# EAGLE design PCB 2.3 (EAGLE 7.6.0)
CNAME: DIY-Thermocam V2; CREVISION: 2.3; DESIGNER: Max Ritter
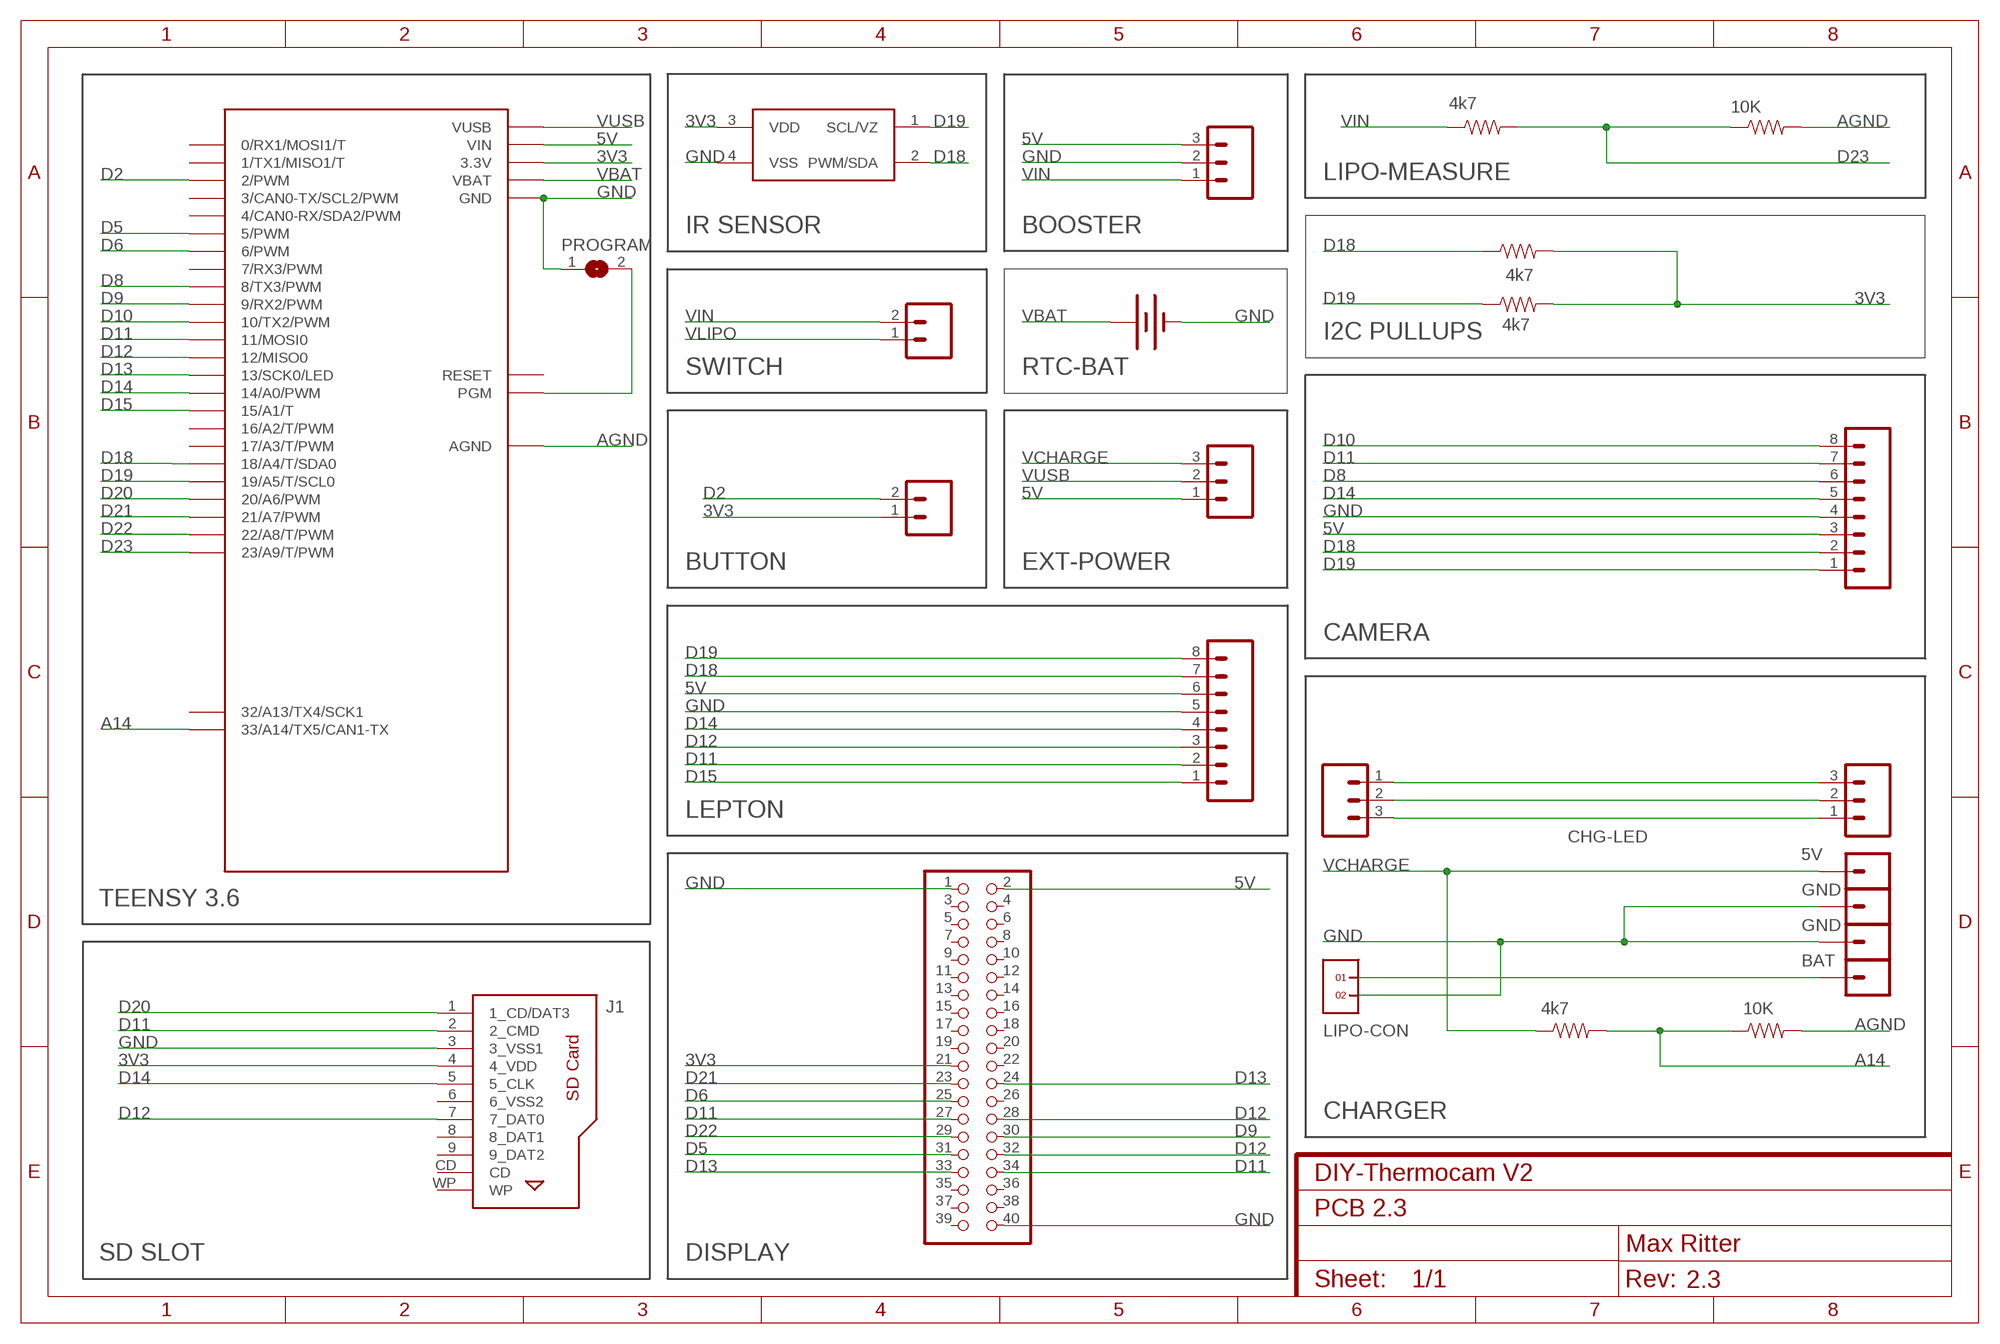
[diagram p0: schematic, sheet 1]

## Parts
BAT  BATTERY12PTH  [BATTCON_12MM_PTH]
BOOSTER  M03PTH  [1X03]
BUTTON  M02PTH  [1X02]
CHG-LED  M03PTH  [1X03]
EXT-POWER  M03PTH  [1X03]
J1  693063020911  [693063020911]
JP1  M01PTH  [1X01]
JP2  M01PTH  [1X01]
JP3  M01PTH  [1X01]
JP4  M01PTH  [1X01]
LASER1  M03PTH  [1X03]
LCD-HEADER  PINHD-2X20  [2X20]
LEPTON_MODULE  M08  [1X08_ROUND]
LEPTON_MODULE1  M08  [1X08_ROUND]
LIPO-CON  1X2  [1X2]
PROGRAM  SJ  [SJ]
R1  4k7  RESISTORPTH-1/4W  [AXIAL-0.4]
R2  10K  RESISTORPTH-1/4W  [AXIAL-0.4]
R3  4k7  RESISTORPTH-1/4W  [AXIAL-0.4]
R4  4k7  RESISTORPTH-1/4W  [AXIAL-0.4]
R5  10K  RESISTORPTH-1/4W  [AXIAL-0.4]
R6  4k7  RESISTORPTH-1/4W  [AXIAL-0.4]
SWITCH  M02PTH  [1X02]
U1  MLX90614_  [TO-39]
U$1  TEENSY_3.6_ALL_PINS  [TEENSY_3.6_ALL_PINS]

## Nets
3V3: BUTTON.1 J1.4(4_VDD) LCD-HEADER.21 R4.P$2 R6.P$2 U1.3(VDD) U$1.3.3V U$1.3.3V3(3.3V) U$1.3.3V4(3.3V)
5V: BOOSTER.3 EXT-POWER.1 LCD-HEADER.2 LEPTON_MODULE1.3 LEPTON_MODULE.6 U$1.VIN
A14: R3.P$2 R5.P$1 U$1.33/A14(33/A14/TX5/CAN1-TX)
AGND: R2.P$2 R5.P$2 U$1.AGND
D2: BUTTON.2 U$1.2(2/PWM)
D5: LCD-HEADER.31 U$1.5(5/PWM)
D6: LCD-HEADER.25 U$1.6(6/PWM)
D8: LEPTON_MODULE1.6 U$1.8(8/TX3/PWM)
D9: LCD-HEADER.30 U$1.9(9/RX2/PWM)
D10: LEPTON_MODULE1.8 U$1.10(10/TX2/PWM)
D11: J1.2(2_CMD) LCD-HEADER.27 LCD-HEADER.34 LEPTON_MODULE1.7 LEPTON_MODULE.2 U$1.11(11/MOSI0)
D12: J1.7(7_DAT0) LCD-HEADER.28 LCD-HEADER.32 LEPTON_MODULE.3 U$1.12(12/MISO0)
D13: LCD-HEADER.24 LCD-HEADER.33 U$1.13(13/SCK0/LED)
D14: J1.5(5_CLK) LEPTON_MODULE1.5 LEPTON_MODULE.4 U$1.14/A0(14/A0/PWM)
D15: LEPTON_MODULE.1 U$1.15/A1(15/A1/T)
D18: LEPTON_MODULE1.2 LEPTON_MODULE.7 R4.P$1 U1.2(PWM/SDA) U$1.18/A4(18/A4/T/SDA0)
D19: LEPTON_MODULE1.1 LEPTON_MODULE.8 R6.P$1 U1.1(SCL/VZ) U$1.19/A5(19/A5/T/SCL0)
D20: J1.1(1_CD/DAT3) U$1.20/A6(20/A6/PWM)
D21: LCD-HEADER.23 U$1.21/A7(21/A7/PWM)
D22: LCD-HEADER.29 U$1.22/A8(22/A8/T/PWM)
D23: R1.P$2 R2.P$1 U$1.23/A9(23/A9/T/PWM)
GND: BAT.GND(-) BOOSTER.2 J1.3(3_VSS1) JP1.1 JP2.1 LCD-HEADER.1 LCD-HEADER.40 LEPTON_MODULE1.4 LEPTON_MODULE.5 LIPO-CON.2 PROGRAM.1 U1.4(VSS) U$1.GND U$1.GND1(GND) U$1.GND6(GND)
N$4: CHG-LED.3 LASER1.1
N$16: CHG-LED.2 LASER1.2
N$18: CHG-LED.1 LASER1.3
N$42: PROGRAM.2 U$1.PGM
VBAT: BAT.VCC@1(+) U$1.VBAT
VCHARGE: EXT-POWER.3 JP4.1 R3.P$1
VIN: BOOSTER.1 R1.P$1 SWITCH.2
VLIPO: JP3.1 LIPO-CON.1 SWITCH.1
VUSB: EXT-POWER.2 U$1.VUSB
Unconnected: J1.6(6_VSS2) J1.8(8_DAT1) J1.9(9_DAT2) J1.CD J1.WP LCD-HEADER.3 LCD-HEADER.4 LCD-HEADER.5 LCD-HEADER.6 LCD-HEADER.7 LCD-HEADER.8 LCD-HEADER.9 LCD-HEADER.10 LCD-HEADER.11 LCD-HEADER.12 LCD-HEADER.13 LCD-HEADER.14 LCD-HEADER.15 LCD-HEADER.16 LCD-HEADER.17 LCD-HEADER.18 LCD-HEADER.19 LCD-HEADER.20 LCD-HEADER.22 LCD-HEADER.26 LCD-HEADER.35 LCD-HEADER.36 LCD-HEADER.37 LCD-HEADER.38 LCD-HEADER.39 U$1.0(0/RX1/MOSI1/T) U$1.1(1/TX1/MISO1/T) U$1.3(3/CAN0-TX/SCL2/PWM) U$1.4(4/CAN0-RX/SDA2/PWM) U$1.7(7/RX3/PWM) U$1.16/A2(16/A2/T/PWM) U$1.17/A3(17/A3/T/PWM) U$1.32/A13(32/A13/TX4/SCK1) U$1.RESET

## Notes on the sheet
- LIPO-MEASURE
- IR SENSOR | BOOSTER
- I2C PULLUPS
- SWITCH | RTC-BAT
- BUTTON | EXT-POWER
- CAMERA
- LEPTON
- 5V
- GND
- TEENSY 3.6
- GND
- BAT
- CHARGER
- SD SLOT | DISPLAY

## Library data of the parts
BAT = SparkFun-Electromechanical:BATTERY: Battery Holders Various common sizes : AA, AAA, 18650 (PRT-12895), 20mm coin cell and 12mm coin cell. 20MM_4LEGS, BATT-10373
BOOSTER CHG-LED EXT-POWER LASER1 = SparkFun-Connectors:M03: Header 3 Standard 3-pin 0.1" header. Use with straight break away headers (SKU : PRT-00116), right angle break away headers (PRT-00553), swiss pins (PRT-00743), machine pins (PRT-00117), and female headers (PRT-00115). Molex polarized connector foot print use with SKU : PRT-08232 with associated crimp pins and housings.
BUTTON SWITCH = SparkFun-Connectors:M02: Standard 2-pin 0.1" header. Use with - straight break away headers ( PRT-00116) - right angle break away headers (PRT-00553) - swiss pins (PRT-00743) - machine pins (PRT-00117) - female headers (PRT-00115) Molex polarized connector foot print use with: PRT-08233 with associated crimp pins and housings. 2.54_SCREWTERM for use with PRT-10571. 3.5mm Screw Terminal footprints for PRT-08084 5mm Screw Terminal footprints for use with PRT-08432
J1 = EAGLE-INPUT_OUTPUT_CONNECTORS-rev16b:693063020911: WR-CRD SD CARD CONNECTOR PUSH & PULL SHORT TYPE WITH CARD DETECTION 9PINS=>Code : Con_I-O_COM_CRD_SD_Normal_693063020911 <http://katalog.we-online.de/media/images/eican/Con_I-O_COM_CRD_SD_Normal_693063020911_pf2.jpg> Details see: http://katalog.we-online.de/en/em/693_063_020_911 Created 2014-07-09, Karrer Zheng 2014 (C) Würth Elektronik
JP1-JP4 = SparkFun-Connectors:M01: Header 1 Standard 1-pin 0.1" header. Use with straight break away headers (SKU : PRT-00116), right angle break away headers (PRT-00553), swiss pins (PRT-00743), machine pins (PRT-00117), and female headers (PRT-00115).
LCD-HEADER = pinhead:PINHD-2X20: PIN HEADER
LEPTON_MODULE LEPTON_MODULE1 = SparkFun-Connectors:M08: Header 8 Standard 8-pin 0.1" header. Use with straight break away headers (SKU : PRT-00116), right angle break away headers (PRT-00553), swiss pins (PRT-00743), machine pins (PRT-00117), and female headers (PRT-00115).
LIPO-CON = headers(2mm):1X2
PROGRAM = jumper:SJ: SMD solder JUMPER
R1-R6 = SparkFun-Resistors:RESISTOR: Resistor Basic schematic elements and footprints for 0603, 1206, and PTH resistors.
U1 = SparkFun-Sensors:MLX90614: Non-contact PIR I2C interface temperature sensor
U$1 = Teensy_3_and_LC_Series_Boards_v1.4:TEENSY_3.6_ALL_PINS: All PIN version of the Teensy 3.6.

## Board
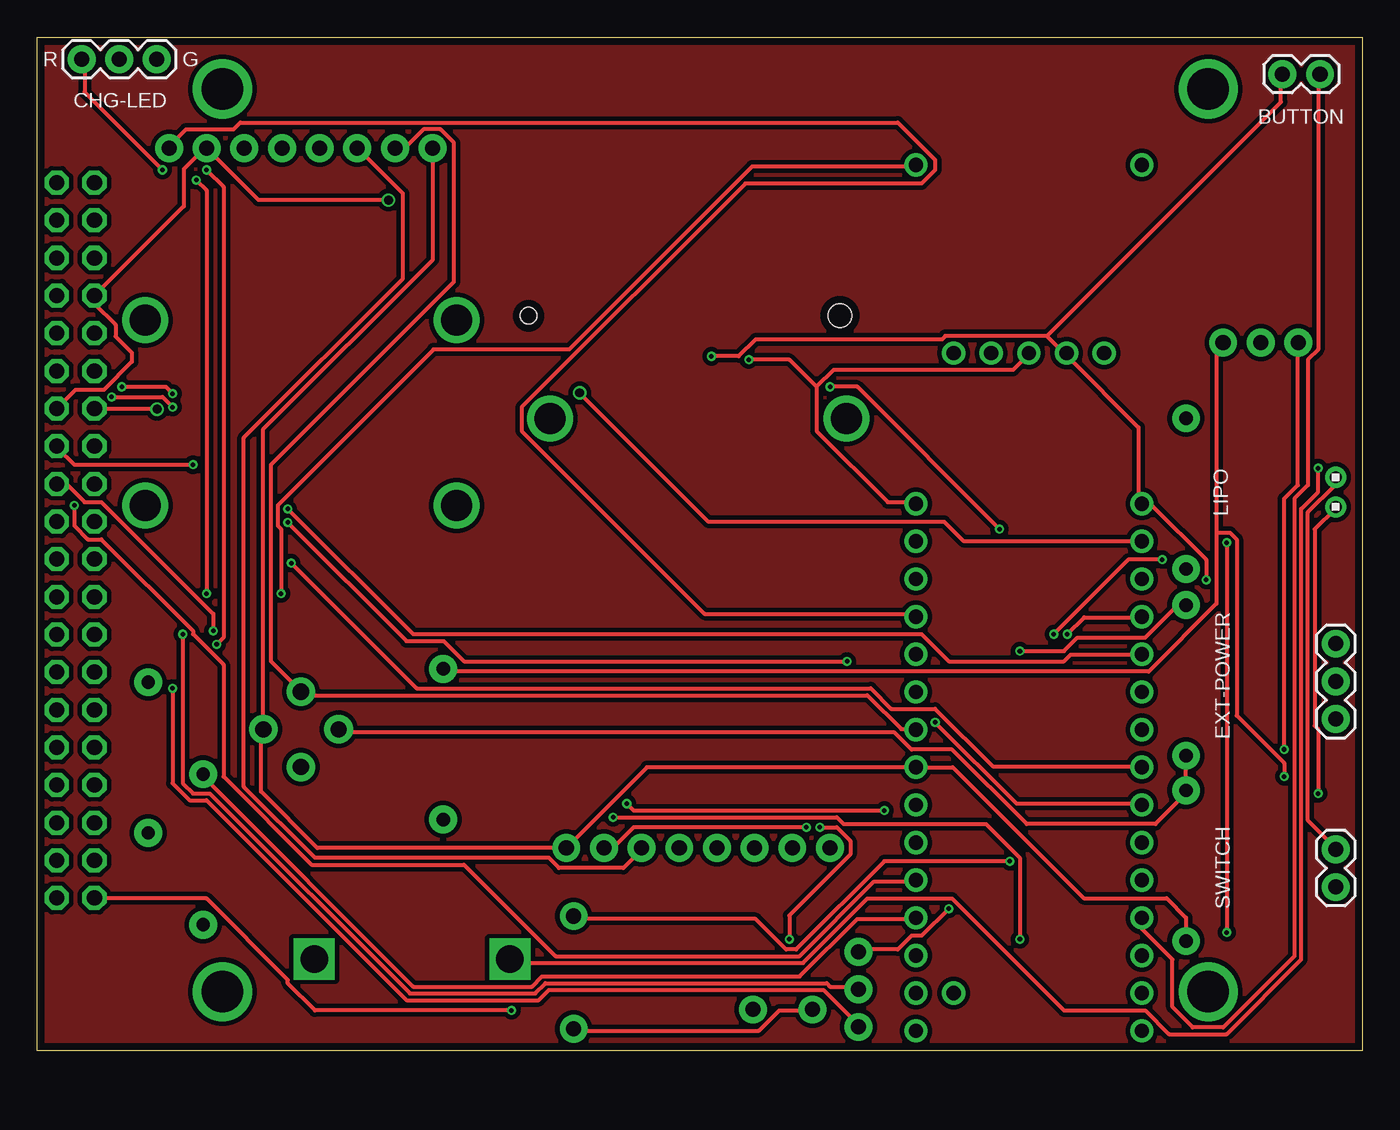
[diagram p1: board, top side]
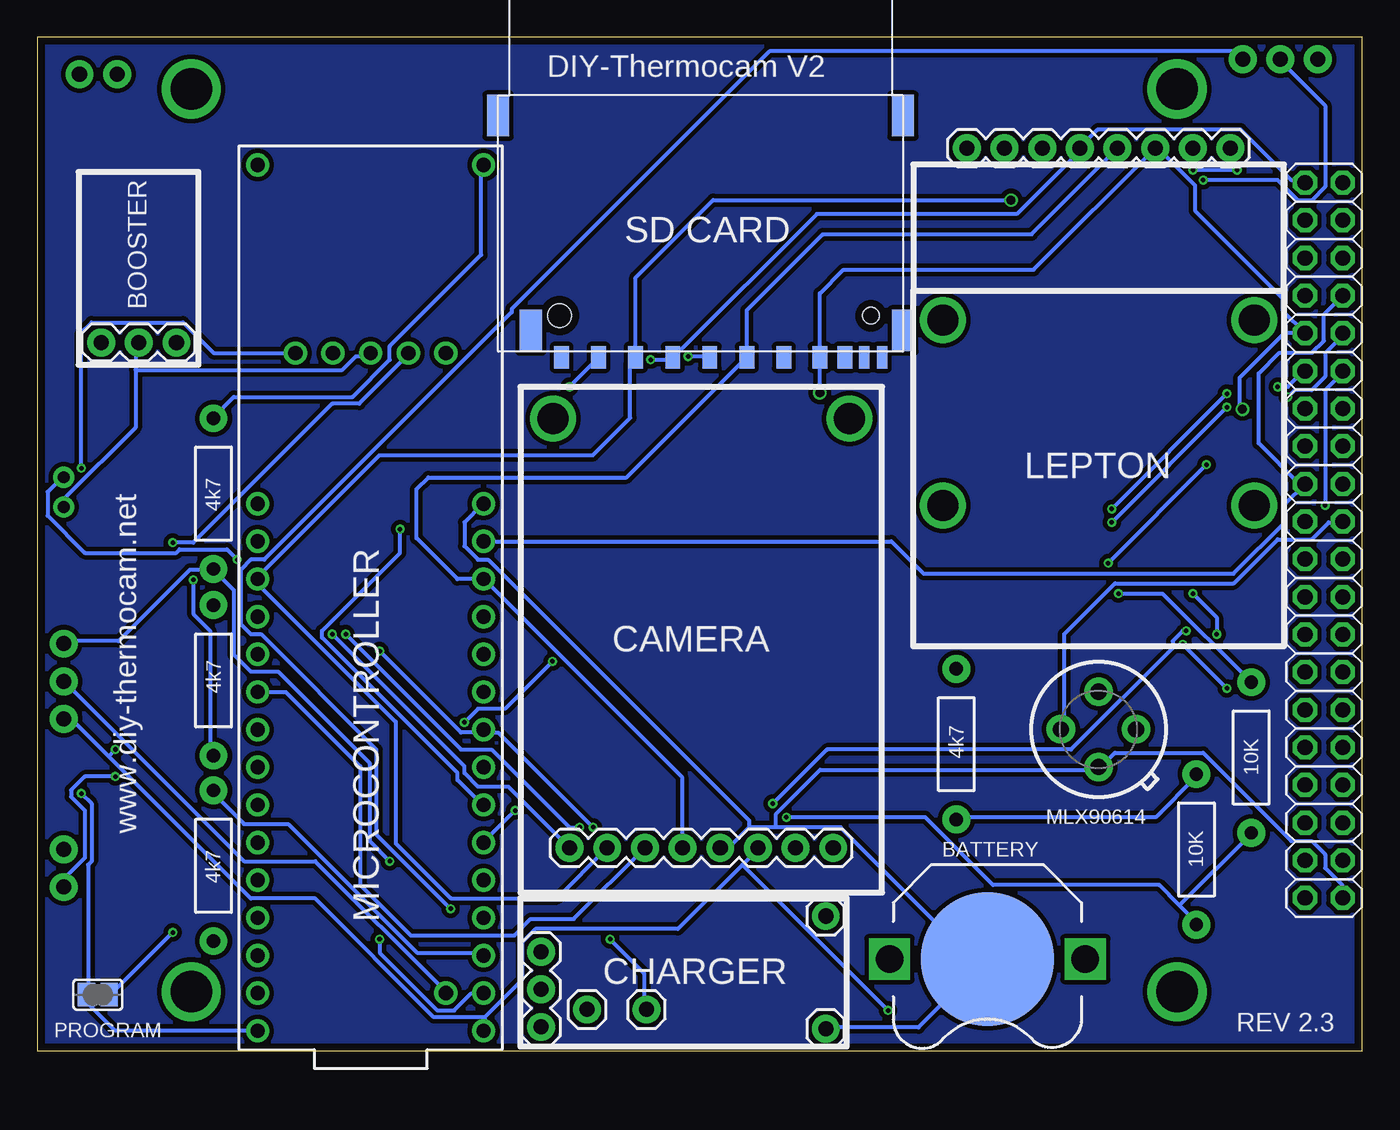
[diagram p2: board, bottom side, seen from below]

Size 89.4 x 68.4 mm. Coordinates in mm from the lower left corner, seen from the top.
Outline: 89.4,0 0,0 0,68.4 89.4,68.4 89.4,0
Copper layers (1*16): Top 0.035mm / dielectric 1.5mm / Bottom 0.035mm
Design rules "EagleRules *": minimum track width 10mil, minimum drill 12mil, track to track 8mil, track to pad 8mil, pad to pad 8mil, via to via 8mil, smd to smd 0mil, copper to edge 20mil, drill to drill 10mil, minimum pad ring 12mil, minimum via ring 6mil, stop-mask expansion 2mil, vias tented up to drill 25mil, thermal gap 10mil

### Footprints (pad centres in the part's own frame; a part is rotated, then mirrored left to right if it is on the bottom)
BATTCON_12MM_PTH = smd 9 x 9: GND 0,0 | drill 1.854 square: VCC@1 6.604,0; VCC@2 -6.604,0
1X03 = drill 1.016 pad 1.88: 1 0,0; 2 2.54,0; 3 5.08,0
1X02 = drill 1.016 pad 1.88: 1 0,0; 2 2.54,0
693063020911 = smd 1 x 1.5: 1 19.125,0; 2 16.625,0; 3 14.125,0; 4 11.625,0; 5 9.125,0; 6 6.625,0; 7 4.2,0; 8 2.5,0; 9 21.625,0 | smd 0.7 x 1.5: CD 1.2,0; WP 0,0 | smd 1.5 x 2.8: P$12 -1.4,-1.8; P$13 23.7,-1.8; P$14 -1.4,-16.3; P$15 25.9,-16.3 | hole 1.1: 0.75,-2.8 | hole 1.6: 21.75,-2.8
1X01 = drill 1.016 pad 1.88: 1 0,0
2X20 = drill 1.016 octagon: 1 -24.13,-1.27; 2 -24.13,1.27; 3 -21.59,-1.27; 4 -21.59,1.27; 5 -19.05,-1.27; 6 -19.05,1.27; 7 -16.51,-1.27; 8 -16.51,1.27; 9 -13.97,-1.27; 10 -13.97,1.27; 11 -11.43,-1.27; 12 -11.43,1.27; 13 -8.89,-1.27; 14 -8.89,1.27; 15 -6.35,-1.27; 16 -6.35,1.27; 17 -3.81,-1.27; 18 -3.81,1.27; 19 -1.27,-1.27; 20 -1.27,1.27; 21 1.27,-1.27; 22 1.27,1.27; 23 3.81,-1.27; 24 3.81,1.27; 25 6.35,-1.27; 26 6.35,1.27; 27 8.89,-1.27; 28 8.89,1.27; 29 11.43,-1.27; 30 11.43,1.27; 31 13.97,-1.27; 32 13.97,1.27; 33 16.51,-1.27; 34 16.51,1.27; 35 19.05,-1.27; 36 19.05,1.27; 37 21.59,-1.27; 38 21.59,1.27; 39 24.13,-1.27; 40 24.13,1.27
1X08_ROUND = drill 1.016 pad 1.88: 1 0,0; 2 2.54,0; 3 5.08,0; 4 7.62,0; 5 10.16,0; 6 12.7,0; 7 15.24,0; 8 17.78,0
1X2 = drill 0.8 pad 1.422: 1 -1,0; 2 1,0
SJ = smd 1.168 x 1.6: 1 -0.762,0; 2 0.762,0
AXIAL-0.4 = drill 0.9 pad 1.88: P$1 -5.08,0; P$2 5.08,0
TO-39 = drill 1.1 pad 1.93: 1 2.54,0; 2 0,2.54; 3 -2.54,0; 4 0,-2.54
TEENSY_3.6_ALL_PINS = drill 0.965: 0 -7.62,25.4; 1 -7.62,22.86; 2 -7.62,20.32; 3 -7.62,17.78; 3.3V 7.62,22.86; 3.3V3 -7.62,-7.62; 3.3V4 -2.54,-17.78; 4 -7.62,15.24; 5 -7.62,12.7; 6 -7.62,10.16; 7 -7.62,7.62; 8 -7.62,5.08; 9 -7.62,2.54; 10 -7.62,0; 11 -7.62,-2.54; 12 -7.62,-5.08; 13 7.62,-5.08; 14/A0 7.62,-2.54; 15/A1 7.62,0; 16/A2 7.62,2.54; 17/A3 7.62,5.08; 18/A4 7.62,7.62; 19/A5 7.62,10.16; 20/A6 7.62,12.7; 21/A7 7.62,15.24; 22/A8 7.62,17.78; 23/A9 7.62,20.32; 32/A13 -7.62,-30.48; 33/A14 7.62,-30.48; AGND 7.62,25.4; GND -7.62,27.94; GND1 7.62,-7.62; GND6 0,-17.78; PGM 2.54,-17.78; RESET 5.08,-17.78; VBAT -5.08,-17.78; VIN 7.62,27.94; VUSB 5.08,25.4

### Placement (x,y rotation side)
BAT  25.3,6.2 180 bottom
BOOSTER  80,47.8 180 bottom
BUTTON  84,65.9 0 top
CHG-LED  3,66.9 0 top
EXT-POWER  87.6,22.4 90 top
J1  32.4,46.8 180 bottom
JP1  36.2,1.5 0 bottom
JP2  52.3,2.8 0 bottom
JP3  48.3,2.8 0 bottom
JP4  36.2,9.1 0 bottom
LASER1  55.4,6.7 270 bottom
LCD-HEADER  2.6,34.45 90 bottom
LEPTON_MODULE  8.9,60.9 180 bottom
LEPTON_MODULE1  35.7,13.7 180 bottom
LIPO-CON  87.6,37.7 270 top
PROGRAM  85.3,3.8 0 bottom
R1  27.4,20.7 270 bottom
R2  11.2,13.6 270 bottom
R3  77.5,37.6 90 bottom
R4  77.5,25 270 bottom
R5  7.5,19.8 270 bottom
R6  77.5,12.5 90 bottom
SWITCH  87.6,13.6 270 top
U1  17.8,21.7 0 bottom
U$1  66.9,29.3 180 top

### Tracks (layer width: path | path; a pad name or v marks a point on that pad's centre or on a via)
3V3  (via drill 0.3)
  Top 0.254: R4.P$2 77.5,19.89 77.5,17.6 R6.P$2 77.5,17.37 75.44,15.32 66.75,15.32 61.72,20.34 58.98,20.34 57.84,21.49 20.34,21.49 U1.3 | v45.49,46.86 47.32,46.86 48.46,48.01 61.04,48.01 61.27,48.23 68.12,48.23 | 68.12,48.23 69.27,47.09 U$1.3.3V4 69.49,46.86 74.3,42.06 74.3,37.03 U$1.3.3V3 74.52,36.8 75.21,36.8 78.87,33.15 v78.87,31.77 | 68.12,48.23 83.9,64.01 83.9,65.84 BUTTON.1
  Bottom 0.254: LCD-HEADER.21 1.37,35.66 2.29,35.66 3.43,34.52 5.71,34.52 8.69,31.55 16.69,31.55 20.12,28.12 20.12,21.72 U1.3 | U$1.3.3V 59.44,6.63 63.78,6.63 72.47,15.32 75.44,15.32 77.5,17.37 R6.P$2 | v45.49,46.86 44.12,46.86 J1.4 | v78.87,31.77 78.87,29.49 77.72,28.35 77.72,20.12 R4.P$2
5V  (via drill 0.3)
  Top 0.254: v32,2.74 18.75,2.74 16.92,4.57 16.92,4.8 11.43,10.29 3.89,10.29 LCD-HEADER.2 | LEPTON_MODULE.6 21.72,60.81 24.69,57.84 24.69,52.12 13.95,41.38 13.95,17.83 18.75,13.03 34.52,13.03 35.2,12.34 39.55,12.34 40.69,13.49 LEPTON_MODULE1.3 | v84.12,20.34 84.12,37.26 85.04,38.18 85.04,47.78 BOOSTER.3
  Bottom 0.254: 59.21,2.29 59.21,1.37 U$1.VIN | 59.21,2.29 56.69,4.8 56.69,7.32 55.78,8.23 46.18,8.23 41.83,12.57 | 41.83,12.57 40.92,13.49 LEPTON_MODULE1.3 | 41.83,12.57 v32,2.74 | 84.58,19.89 74.98,10.29 70.64,10.29 62.64,2.29 59.21,2.29 | 84.58,19.89 86.87,22.17 87.55,22.17 EXT-POWER.1 | 84.58,19.89 v84.12,20.34
A14  (via drill 0.3)
  Top 0.254: v16.46,30.86 16.46,35.2 16.23,35.43 16.23,36.8 26.75,47.32 35.89,47.32 48.23,59.66 59.21,59.66 U$1.33/A14
  Bottom 0.254: U$1.33/A14 59.44,59.66 59.44,53.72 65.61,47.55 65.61,46.63 68.12,44.12 76.12,44.12 77.5,42.75 R3.P$2 | v16.46,30.86 13.49,30.86 7.54,24.92 R5.P$1
AGND  (via drill 0.3)
  Top 0.254: v66.29,7.54 66.29,13.03 64.01,15.32 54.41,15.32 53.95,15.77 v38.86,15.77
  Bottom 0.254: v66.29,7.54 66.29,6.63 62.41,2.74 61.27,2.74 60.12,3.89 59.44,3.89 U$1.AGND | v38.86,15.77 29.49,15.77 24.92,11.2 13.72,11.2 12.34,9.83 | 12.34,9.83 11.2,8.69 R2.P$2 | 12.34,9.83 7.54,14.63 R5.P$2
D2
  Top 0.254: U$1.2 74.52,8.91 74.52,8.23 76.58,6.17 76.58,2.97 77.95,1.6 80.01,1.6 84.81,6.4 84.81,37.26 85.72,38.18 85.72,46.63 86.41,47.32 86.41,65.84 BUTTON.2
D5  (via drill 0.3)
  Top 0.254: v60.58,22.17 66.06,16.69 74.3,16.69 U$1.5 | v54.63,26.29 28.8,26.29 27.43,27.66 24.92,27.66 v16.92,35.66 | v9.14,43.43 8.46,44.12 v5.03,44.12
  Bottom 0.254: v60.58,22.17 59.66,23.09 57.84,23.09 v54.63,26.29 | v9.14,43.43 v16.92,35.66 | v5.03,44.12 4.57,44.58 3.43,44.58 2.52,45.49 2.52,47.09 1.37,48.23 LCD-HEADER.31
D6  (via drill 0.3)
  Top 0.254: v17.14,32.92 25.6,24.46 56.24,24.46 57.61,23.09 60.58,23.09 64.47,19.2 74.3,19.2 U$1.6 | v10.52,39.55 2.52,39.55 1.37,40.69 LCD-HEADER.25
  Bottom 0.254: v10.52,39.55 v17.14,32.92
D8
  Bottom 0.254: U$1.8 72.62,24.22 67.6,19.2 67.6,11.2 64.2,7.8 57.2,7.8 56.1,8.9 53.2,8.9 LEPTON_MODULE1.6
D9  (via drill 0.3)
  Top 0.254: v16.92,36.58 25.38,28.12 59.66,28.12 61.49,26.29 69.27,26.29 69.72,26.75 74.3,26.75 U$1.9 | v9.14,44.35 8.69,44.81 v5.71,44.81
  Bottom 0.254: v9.14,44.35 v16.92,36.58 | v5.71,44.81 5.03,44.81 3.89,45.95 LCD-HEADER.30
D10  (via drill 0.3)
  Top 0.254: v69.49,28.12 70.64,29.26 74.3,29.26 U$1.10
  Bottom 0.254: v69.49,28.12 60.58,19.2 60.58,18.75 59.66,17.83 57.61,17.83 53.49,13.72 LEPTON_MODULE1.8
D11  (via drill 0.6)
  Top 0.254: v23.7,57.4 14.94,57.4 LEPTON_MODULE.2 11.3,60.9 9.9,59.5 9.9,56.99 LCD-HEADER.34 3.87,50.43 5.3,49 5.3,48.2 6.4,47.1 6.4,46.5 4.5,44.6 2.59,44.6 LCD-HEADER.27
  Bottom 0.254: LEPTON_MODULE1.7 54.34,10.3 61.5,10.3 65.2,14 65.2,22.2 74.52,31.52 U$1.11 74.52,31.98 66.3,40.2 51.9,40.2 49.4,42.7 49.4,46.42 J1.2 49.02,52.17 43.8,57.4 v23.7,57.4
D12  (via drill 0.6)
  Top 0.254: U$1.12 62.52,34.38 61.2,35.7 45.3,35.7 v36.6,44.4 | v8.1,43.3 3.91,43.3 LCD-HEADER.28
  Bottom 0.254: v36.6,44.4 J1.7 36.6,51.1 35,52.7 22.18,52.7 LEPTON_MODULE.3 13.8,60.9 11.3,58.4 11.3,56.7 5.4,50.8 5.4,49.95 LCD-HEADER.32 5.28,48.42 8.3,45.4 8.3,43.5 v8.1,43.3
D13
  Bottom 0.254: U$1.13 31.78,34.38 29.6,32.2 8.7,32.2 5.2,35.7 5.2,36.93 LCD-HEADER.24 4.26,38.26 7,41 7,45.7 5.6,47.1 3.4,47.1 2.6,47.9 2.6,49.69 LCD-HEADER.33
D14
  Bottom 0.254: LEPTON_MODULE1.5 45.9,13.74 45.9,18.5 59.24,31.84 U$1.14/A0 61.04,31.84 63.8,34.6 63.8,37.9 63,38.7 49.62,38.7 J1.5 41.52,49.98 36.4,55.1 22.32,55.1 LEPTON_MODULE.4
D15
  Top 0.254: U$1.15/A1 59.21,29.49 45.03,29.49 32.69,41.83 32.69,43.43 47.78,58.52 59.66,58.52 60.58,59.44 60.58,60.12 58.06,62.64 13.72,62.64 13.26,62.18 10.06,62.18 8.91,61.04 LEPTON_MODULE.1
D18  (via drill 0.3)
  Top 0.254: U$1.18/A4 59.21,21.72 58.29,21.72 56.01,24 18.06,24 17.83,24.23 U1.2 17.6,24.46 15.77,26.29 15.77,39.55 28.12,51.89 28.12,61.27 27.2,62.18 26.06,62.18 24.92,61.04 24.23,61.04 LEPTON_MODULE.7 | v51.89,15.09 40.23,15.09 38.86,13.72 38.41,13.72 LEPTON_MODULE1.2 | v66.29,26.98 69.27,26.98 70.18,27.89 74.75,27.89 76.81,29.95 77.5,29.95 R4.P$1
  Bottom 0.254: v51.89,15.09 58.29,21.49 59.21,21.49 U$1.18/A4 59.44,21.49 60.81,21.49 v66.29,26.98
D19
  Top 0.254: R6.P$1 77.5,9 76.2,10.3 70.6,10.3 61.76,19.14 U$1.19/A5 41.14,19.14 LEPTON_MODULE1.1 18.9,13.7 15.1,17.5 15.1,21.54 U1.1 15.26,41.96 26.7,53.4 26.7,60.88 LEPTON_MODULE.8
D20  (via drill 0.3)
  Top 0.254: v53.49,44.81 55.32,44.81 v64.92,35.2
  Bottom 0.254: v53.49,44.81 51.66,46.63 J1.1 | v64.92,35.2 64.92,33.6 70.18,28.35 70.18,27.89 61.04,18.75 61.04,18.29 59.44,16.69 U$1.20/A6
D21  (via drill 0.3)
  Top 0.254: v57.15,16.23 40.23,16.23 v39.78,16.69 | v11.89,28.35 11.89,29.49 4.34,37.03 3.2,37.03 2.06,38.18 1.37,38.18 LCD-HEADER.23
  Bottom 0.254: v57.15,16.23 59.21,14.17 U$1.21/A7 | v39.78,16.69 36.12,20.34 19.66,20.34 12.8,27.2 12.8,27.66 12.12,28.35 v11.89,28.35
D22  (via drill 0.3)
  Top 0.254: v2.52,36.8 2.52,35.43 3.43,34.52 4.34,34.52 10.52,28.35 10.52,28.12 12.57,26.06 12.57,18.52 18.52,12.57 28.8,12.57 34.98,6.4 51.44,6.4 56.46,11.43 59.21,11.43 U$1.22/A8
  Bottom 0.254: v2.52,36.8 2.52,44.58 1.37,45.72 LCD-HEADER.29
D23
  Top 0.254: U$1.23/A9 59.21,8.91 55.32,8.91 51.44,5.03 34.06,5.03 33.38,4.34 25.38,4.34 11.2,18.52 R2.P$1
  Bottom 0.254: R1.P$2 27.2,15.77 13.95,15.77 11.2,18.52 R2.P$1
GND  (via drill 0.3)
  Top 0.254: JP2.1 52.12,2.74 50.06,2.74 48.69,1.37 36.35,1.37 JP1.1 | 52.58,44.81 52.58,41.83 57.38,37.03 59.21,37.03 U$1.GND1 | 52.58,44.81 53.72,45.95 65.84,45.95 66.75,46.86 U$1.GND6 | v86.41,17.37 86.41,21.72 86.18,21.95 86.18,35.2 87.55,36.58 LIPO-CON.2 | v48.01,46.63 50.75,46.63 52.58,44.81
  Bottom 0.254: LCD-HEADER.1 1.37,10.52 1.37,11.2 2.52,12.34 2.52,13.26 3.43,14.17 4.8,14.17 10.74,20.12 16.69,20.12 17.6,19.2 U1.4 17.83,18.97 36.58,18.97 39.55,16 39.55,15.09 | 25.83,5.71 25.38,6.17 BAT.GND 25.83,5.71 | 25.83,5.71 29.95,1.6 36.12,1.6 JP1.1 | 41.38,15.09 42.75,13.72 43.2,13.72 LEPTON_MODULE1.4 | 39.55,15.09 35.2,15.09 25.83,5.71 | 39.55,15.09 41.38,15.09 | LCD-HEADER.40 3.89,58.75 4.8,58.75 8.23,62.18 17.83,62.18 18.97,61.04 LEPTON_MODULE.5 18.97,60.81 23.32,56.46 36.8,56.46 46.41,46.86 J1.3 46.63,46.63 v48.01,46.63 | U$1.GND 74.52,1.37 84.12,1.37 85.95,3.2 85.95,3.66 PROGRAM.1 85.95,3.89 85.95,12.57 85.72,12.8 85.72,16.69 v86.41,17.37 | 82.75,45.95 82.75,47.78 BOOSTER.2 | 82.75,45.95 82.75,42.06 87.55,37.26 87.55,36.8 LIPO-CON.2 | 82.75,45.95 68.81,45.95 67.89,46.86 66.98,46.86 U$1.GND6 | 41.38,15.09 41.38,15.54 58.98,33.15 59.66,33.15 60.58,34.06 60.58,35.66 59.44,36.8 U$1.GND1
N$1  (via drill 2.8 pad 4)
  other vias: 12.5,64.9
N$2
  pour Top (isolate 0.305): 0,0 89.4,0 89.4,68.4 0,68.4
N$3
  pour Bottom (isolate 0.305): 0,0 89.4,0 89.4,68.4 0,68.4
N$4  (via drill 0.3)
  Top 0.254: v61.49,9.6 59.66,7.77 58.98,7.77 58.06,6.86 55.55,6.86 LASER1.1
  Bottom 0.254: v61.49,9.6 66.52,14.63 66.52,20.34 74.3,28.12 74.98,28.12 75.67,28.8 75.67,32.46 74.98,33.15 74.07,33.15 57.38,49.84 57.38,50.06 40.01,67.44 8.69,67.44 8.23,66.98 CHG-LED.3
N$6  (via drill 2.1 pad 3.12)
  other vias: 28.3,36.8
N$7  (via drill 2.8 pad 4)
  other vias: 12.5,4
N$8  (via drill 2.1 pad 3.12)
  other vias: 34.6,42.67
N$9  (via drill 2.1 pad 3.12)
  other vias: 54.6,42.67
N$10  (via drill 2.8 pad 4)
  other vias: 79,4
N$11  (via drill 2.8 pad 4)
  other vias: 79,64.9
N$12  (via drill 2.1 pad 3.12)
  other vias: 7.3,49.3
N$13  (via drill 2.1 pad 3.12)
  other vias: 7.3,36.8
N$14  (via drill 2.1 pad 3.12)
  other vias: 28.3,49.3
N$16  (via drill 0.3)
  Top 0.254: v9.83,28.12 9.83,18.06 10.52,17.37 11.66,17.37 25.15,3.89 33.6,3.89 34.29,4.57 53.26,4.57 53.49,4.34 55.32,4.34 LASER1.2 | v11.43,30.86 11.43,58.06 v10.74,58.75
  Bottom 0.254: v9.83,28.12 9.83,29.26 v11.43,30.86 | v10.74,58.75 5.71,58.75 4.34,57.38 3.43,57.38 2.52,58.29 2.52,63.78 5.49,66.75 CHG-LED.2
N$18  (via drill 0.3)
  Top 0.254: v9.14,24.46 9.14,18.06 10.29,16.92 11.43,16.92 24.92,3.43 33.83,3.43 34.52,4.12 53.03,4.12 55.32,1.83 LASER1.3 | v12.12,27.43 12.57,27.89 12.57,58.29 v11.43,59.44 | v8.46,59.44 3.2,64.69 3.2,66.75 CHG-LED.1
  Bottom 0.254: v12.12,27.43 v9.14,24.46 | v8.46,59.44 v11.43,59.44
N$42  (via drill 0.3)
  Top 0.254: v80.24,34.29 v80.24,8
  Bottom 0.254: v80.24,8 84.35,3.89 PROGRAM.2 | v80.24,34.29 78.87,34.29 69.49,43.66 67.67,43.66 64.47,46.86 U$1.PGM
VBAT  (via drill 0.3)
  Top 0.254: v86.41,39.32 86.41,37.72 85.27,36.58 85.27,6.17 80.24,1.14 76.35,1.14 74.75,2.74 69.27,2.74 61.72,10.29 56.01,10.29 51.66,5.94 32.23,5.94 32,6.17 BAT.VCC@1
  Bottom 0.254: v86.41,39.32 86.41,48.46 85.72,49.15 79.55,49.15 77.5,47.09 72.01,47.09 U$1.VBAT
VCHARGE  (via drill 0.3)
  Top 0.254: v65.61,12.8 57.15,12.8 51.21,6.86 50.52,6.86 48.46,8.91 36.35,8.91 JP4.1
  Bottom 0.254: v65.61,12.8 66.98,14.17 66.98,19.43 73.15,25.6 74.98,25.6 76.12,26.75 76.12,31.09 77.5,32.46 R3.P$1 77.72,32.46 79.1,32.46 83.9,27.66 87.55,27.66 EXT-POWER.3
VIN  (via drill 0.3)
  Top 0.254: 79.55,34.98 79.55,47.55 79.78,47.78 BOOSTER.1 | 79.55,34.98 79.55,30.18 74.98,25.6 27.43,25.6 R1.P$1 | v84.12,18.52 84.12,19.43 80.92,22.63 80.92,34.52 80.47,34.98 79.55,34.98
  Bottom 0.254: v84.12,18.52 86.18,18.52 87.1,17.6 87.1,17.14 86.18,16.23 86.18,13.03 87.55,11.66 87.55,11.2 SWITCH.2
VLIPO  (via drill 0.3)
  Top 0.254: LIPO-CON.1 87.55,38.63 87.55,38.18 85.72,36.35 85.72,15.54 87.55,13.72 SWITCH.1 | v50.75,7.54 50.75,9.14 54.86,13.26 54.86,14.17 53.95,15.09 v52.81,15.09 | v68.58,28.12 73.61,33.15 v75.89,33.15
  Bottom 0.254: v50.75,7.54 48.46,5.26 48.46,2.97 JP3.1 | v52.81,15.09 53.49,15.09 58.75,20.34 60.81,20.34 v68.58,28.12 | v75.89,33.15 76.58,33.83 79.78,33.83 80.01,33.6 86.18,33.6 88.7,36.12 88.7,37.72 87.78,38.63 LIPO-CON.1
VUSB
  Bottom 0.254: U$1.VUSB 61.95,4.12 70.64,12.8 75.44,12.8 87.55,24.92 EXT-POWER.2

### Text on the board
tPlace: R | G | LIPO
bPlace: DIY-Thermocam V2 | SD CARD | BOOSTER | LEPTON | www.diy-thermocam.net | MICROCONTROLLER | CAMERA | MLX90614 | BATTERY | CHARGER | REV 2.3 | PROGRAM